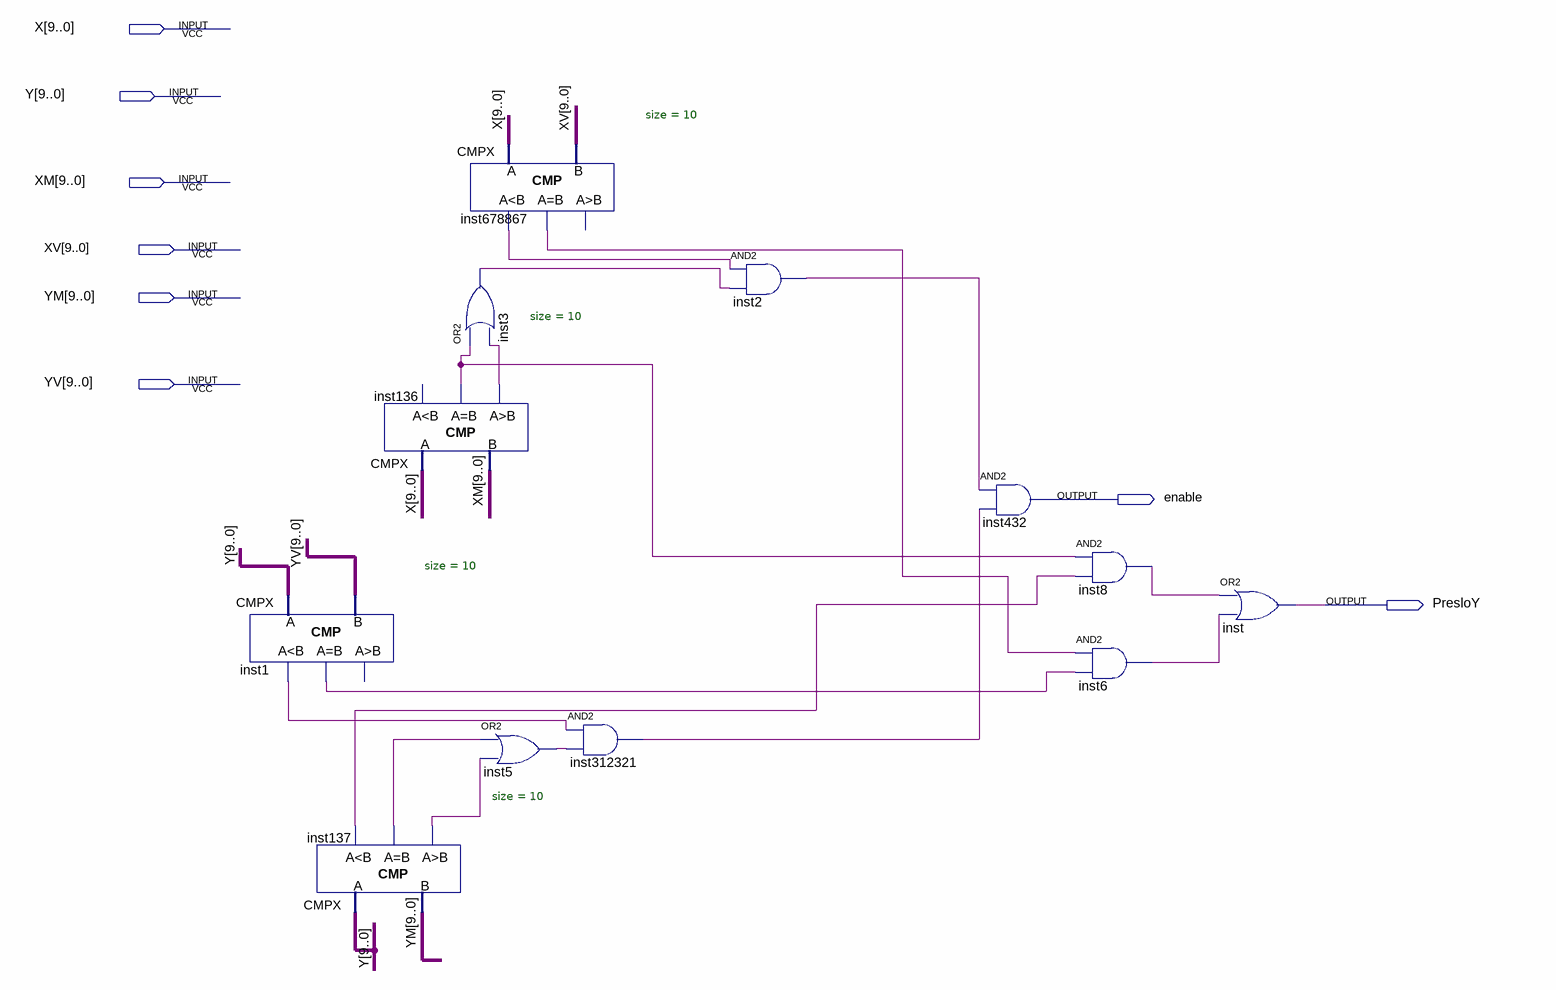
[diagram p0: schematic sheet]
// Quartus schematic crtanje_cetvorougla.bdf as structural Verilog: 12 symbols, 8 pins
module crtanje_cetvorougla (
  input  [9:0] X,
  input  [9:0] Y,
  input  [9:0] XM,
  input  [9:0] XV,
  input  [9:0] YM,
  input  [9:0] YV,
  output enable,
  output PresloY
);

  wire inst1_eq, inst1_ls, inst2_out, inst3_out, inst5_out, inst6_out, inst8_out, inst136_eq, inst136_gr,
       inst137_eq, inst137_gr, inst137_ls, inst312321_out, inst678867_eq, inst678867_ls;

  CMPX #(.size(10)) inst1 (.A(Y), .B(YV), .ls(inst1_ls), .eq(inst1_eq));  // open: gr
  CMPX #(.size(10)) inst137 (.A(Y), .B(YM), .ls(inst137_ls), .eq(inst137_eq), .gr(inst137_gr));
  CMPX #(.size(10)) inst136 (.A(X), .B(XM), .eq(inst136_eq), .gr(inst136_gr));  // open: ls
  CMPX #(.size(10)) inst678867 (.A(X), .B(XV), .ls(inst678867_ls), .eq(inst678867_eq));  // open: gr
  or inst3 (inst3_out, inst136_eq, inst136_gr);
  or inst5 (inst5_out, inst137_eq, inst137_gr);
  and inst312321 (inst312321_out, inst1_ls, inst5_out);
  and inst2 (inst2_out, inst678867_ls, inst3_out);
  and inst432 (enable, inst2_out, inst312321_out);
  and inst8 (inst8_out, inst136_eq, inst137_ls);
  and inst6 (inst6_out, inst678867_eq, inst1_eq);
  or inst (PresloY, inst8_out, inst6_out);
endmodule
